# Altium project pcb.PrjPcb
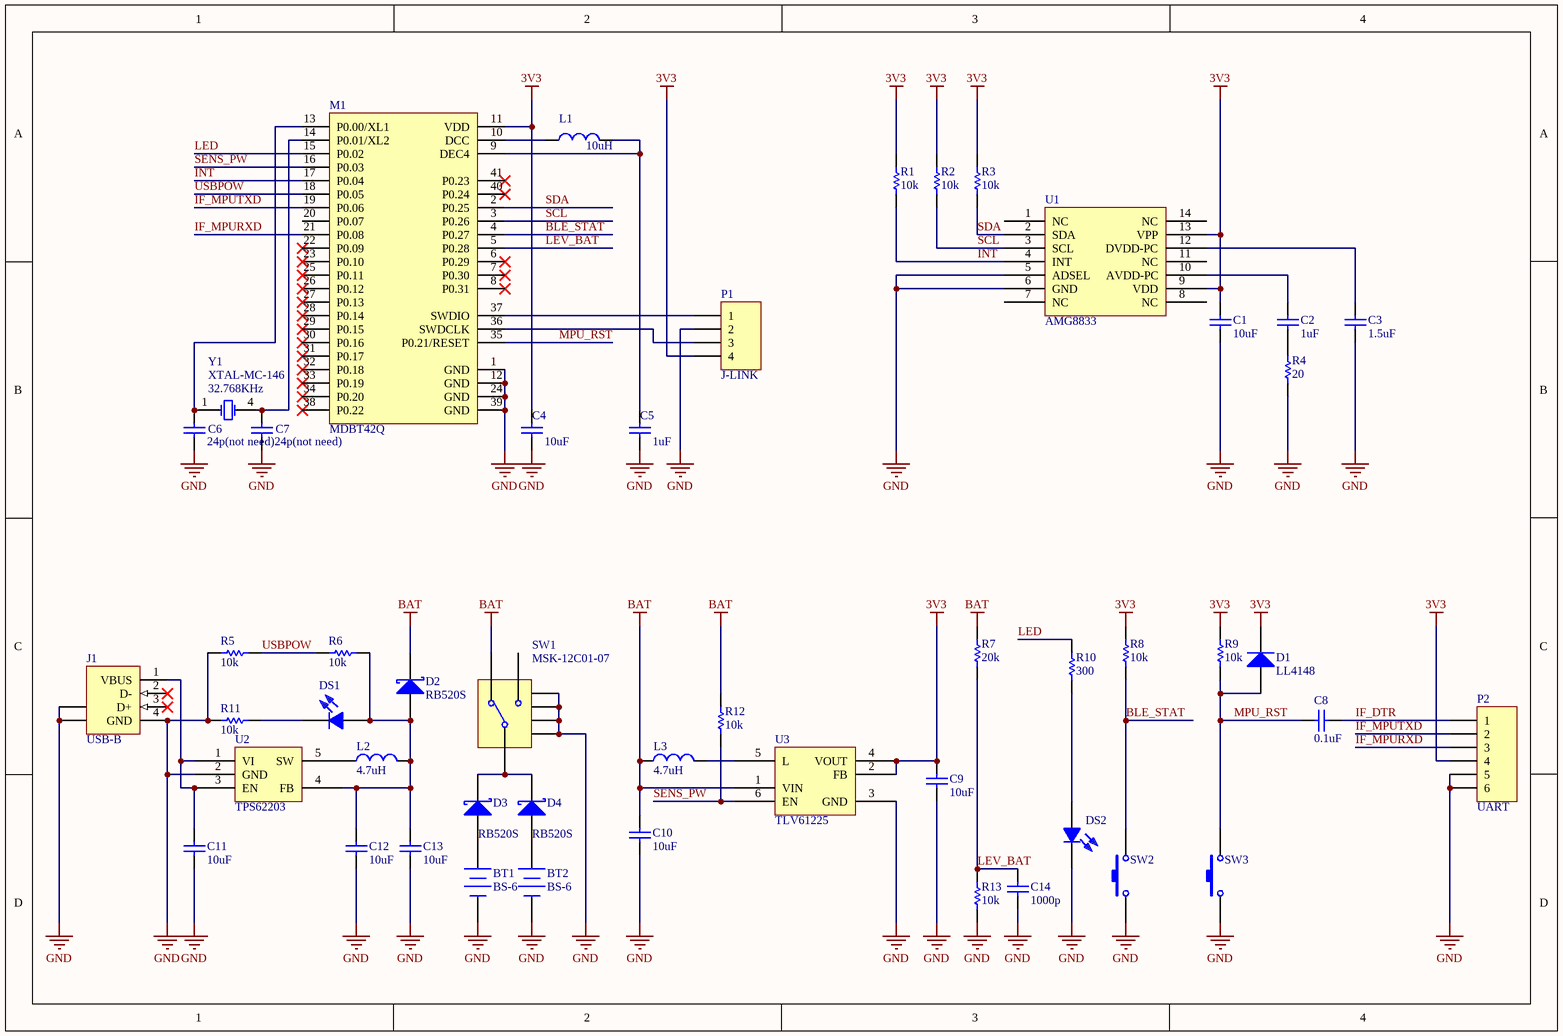
[diagram p0: schematic.SchDoc]
1 sheet, 49 parts. Net scope: global (net labels, ports and power ports of the same name join across sheets).
Board file: pcb.PcbDoc

## Sheet schematic.SchDoc
size A4

### Parts
BT1  BS-6  [BS-6]
BT2  BS-6  [BS-6]
C1  value 10uF  [2012[0805]]  (hidden comment: Cap1)
C2  value 1uF  [2012[0805]]  (hidden comment: Cap1)
C3  value 1.5uF  [2012[0805]]  (hidden comment: Cap1)
C4  value 10uF  [2012[0805]]  (hidden comment: Cap1)
C5  value 1uF  [2012[0805]]  (hidden comment: Cap1)
C6  value 24p(not need)  [2012[0805]]  (hidden comment: Cap1)
C7  value 24p(not need)  [2012[0805]]  (hidden comment: Cap1)
C8  value 0.1uF  [2012[0805]]  (hidden comment: Cap1)
C9  value 10uF  [2012[0805]]  (hidden comment: Cap1)
C10  value 10uF  [2012[0805]]  (hidden comment: Cap1)
C11  value 10uF  [2012[0805]]  (hidden comment: Cap1)
C12  value 10uF  [2012[0805]]  (hidden comment: Cap1)
C13  value 10uF  [2012[0805]]  (hidden comment: Cap1)
C14  value 1000p  [2012[0805]]  (hidden comment: Cap1)
D1  LL4148  [SOD80]
D2  RB520S  [SC-79]
D3  RB520S  [SC-79]
D4  RB520S  [SC-79]
DS1  (no value)  [3216[1206]+A]
DS2  (no value)  [3216[1206]+A]
J1  USB-B  [USB-B-MICRO]
L1  value 10uH  [2012[0805]]  (hidden comment: Inductor)
L2  value 4.7uH  [2012[0805]]  (hidden comment: Inductor)
L3  value 4.7uH  [2012[0805]]  (hidden comment: Inductor)
M1  MDBT42Q  [MDBT42Q]
P1  J-LINK  [HDR1X4]
P2  UART  [HDR1X6]
R1  value 10k  [2012[0805]]  (hidden comment: Res)
R2  value 10k  [2012[0805]]  (hidden comment: Res)
R3  value 10k  [2012[0805]]  (hidden comment: Res)
R4  value 20  [2012[0805]]  (hidden comment: Res)
R5  value 10k  [2012[0805]]  (hidden comment: Res)
R6  value 10k  [2012[0805]]  (hidden comment: Res)
R7  value 20k  [2012[0805]]  (hidden comment: Res)
R8  value 10k  [2012[0805]]  (hidden comment: Res)
R9  value 10k  [2012[0805]]  (hidden comment: Res)
R10  value 300  [2012[0805]]  (hidden comment: Res)
R11  value 10k  [2012[0805]]  (hidden comment: Res)
R12  value 10k  [2012[0805]]  (hidden comment: Res)
R13  value 10k  [2012[0805]]  (hidden comment: Res)
SW1  MSK-12C01-07  [MSK-12C01-07]
SW2  TL3342F160QG  [TL3342F160QG]  (value not drawn)
SW3  TL3342F160QG  [TL3342F160QG]  (value not drawn)
U1  AMG8833  [AMG8833]
U2  TPS62203  [SOT23-5]
U3  TLV61225  [SC72-6]
Y1  XTAL-MC-146  value 32.768KHz  [MC-146]

### Nets
3V3: C1.2 C4.2 C9.2 D1.2(K) M1.11(VDD) P1.4 P2.4 R1.2 R2.2 R3.2 R8.1 R9.1 U1.9(VDD) U1.13(VPP) U3.2(FB) U3.4(VOUT)
BAT: C10.2 D2.2(K) L3.1 R7.1 R12.2 SW1.1 U3.1(VIN)
GND: BT1.2(-) BT2.2(-) C1.1 C3.1 C4.1 C5.1 C6.1 C7.1 C9.1 C10.1 C11.1 C12.1 C13.1 C14.2 DS2.2 J1.4(GND) J1.5(SHLD) J1.6(SHLD) M1.1(GND) M1.12(GND) M1.24(GND) M1.39(GND) P1.2 P2.5 P2.6 R4.1 R5.2 R11.2 R13.2 SW1.4 SW1.5 SW1.6 SW1.7 SW2.1 SW3.1 U1.5(ADSEL) U1.6(GND) U2.2(GND) U3.3(GND)
BLE_STAT: M1.4(P0.27) R8.2 SW2.3
IF_DTR: C8.1 P2.1
IF_MPURXD: M1.21(P0.08) P2.3
IF_MPUTXD: M1.19(P0.06) P2.2
INT: M1.17(P0.04) R1.1 U1.4(INT)
LED: M1.15(P0.02) R10.1
LEV_BAT: C14.1 M1.5(P0.28) R7.2 R13.1
MPU_RST: C8.2 D1.1(A) M1.35(P0.21/RESET) R9.2 SW3.3
SCL: M1.3(P0.26) R2.1 U1.3(SCL)
SDA: M1.2(P0.25) R3.1 U1.2(SDA)
SENS_PW: M1.16(P0.03) R12.1 U3.6(EN)
USBPOW: M1.18(P0.05) R5.1 R6.2
NetBT1_1: BT1.1(+) D3.1(A)
NetBT2_1: BT2.1(+) D4.1(A)
NetC2_1: C2.1 R4.2
NetC2_2: C2.2 U1.10(AVDD-PC)
NetC3_2: C3.2 U1.12(DVDD-PC)
NetC5_2: C5.2 L1.2 M1.9(DEC4)
NetC6_2: C6.2 M1.13(P0.00/XL1) Y1.1(OSC1)
NetC7_2: C7.2 M1.14(P0.01/XL2) Y1.4(OSC2)
NetC11_2: C11.2 J1.1(VBUS) U2.1(VI) U2.3(EN)
NetC12_2: C12.2 C13.2 D2.1(A) DS1.1 L2.2 R6.1 U2.4(FB)
NetD3_2: D3.2(K) D4.2(K) SW1.2
NetDS1_2: DS1.2 R11.1
NetDS2_1: DS2.1 R10.2
NetL1_1: L1.1 M1.10(DCC)
NetL2_1: L2.1 U2.5(SW)
NetL3_2: L3.2 U3.5(L)
NetM1_36: M1.36(SWDCLK) P1.3
NetM1_37: M1.37(SWDIO) P1.1

Not connected (* = marked no-connect by the designer): J1 2(D-)* 3(D+)*; M1 6(P0.29)* 7(P0.30)* 8(P0.31)* 20(P0.07) 22(P0.09)* 23(P0.10)* 25(P0.11)* 26(P0.12)* 27(P0.13)* 28(P0.14)* 29(P0.15)* 30(P0.16)* 31(P0.17)* 32(P0.18)* 33(P0.19)* 34(P0.20)* 38(P0.22)* 40(P0.24)* 41(P0.23)*; SW1 3; U1 1(NC) 7(NC) 8(NC) 11(NC) 14(NC)

### Library data of the parts
DS1 DS2 = LED: color: red
J1 = USB-B: USB 1.1, Right Angle, Thru-Hole, B Type, Receptacle, 4 Position, White; ContactMaterial: Phosphor Bronze; ContactPlating: Gold over Nickel; TerminationLength: 3.00mm [0.118in.]; PCB_Layout: Complies with manufacturer's recommendation.; DrillSize: Corresponds to nominal value.; PanelGround: Without; Published: 15-Jul-2004; DatasheetDocument: 02-Jun-2001; PackageDocument: 02-Jun-2001; PackageReference: 1-1470156; Publisher: Altium Limited; HousingMaterial: Glass-Filled Thermoplastic; ComponentLink1Description: Manufacturer Link; ComponentLink1URL: http://www.tycoelectronics.com/; ComponentLink2Description: Packaging Specification; ComponentLink2URL: http://ecommas.tycoelectronics.com/commerce/DocumentDelivery/DDEController?Action=showdoc&DocId=Customer+Drawing%7F1470156%7FO%7Ftif%7FEnglish%7FC_1470156_O.tif
P1 = Header 4: Header, 4-Pin; LatestRevisionDate: 17-Jul-2002; LatestRevisionNote: Re-released for DXP Platform.; Publisher: Altium Limited
P2 = Header 6: Header, 6-Pin; LatestRevisionDate: 17-Jul-2002; LatestRevisionNote: Re-released for DXP Platform.; Publisher: Altium Limited
BT1 BT2 = BS-6: Published: 24-Mar-1999; LatestRevisionDate: 17-Jul-2002; LatestRevisionNote: Re-released for DXP Platform.; PackageReference: BAT-2; Publisher: Altium Limited; PackageDescription: Battery; 2 Leads